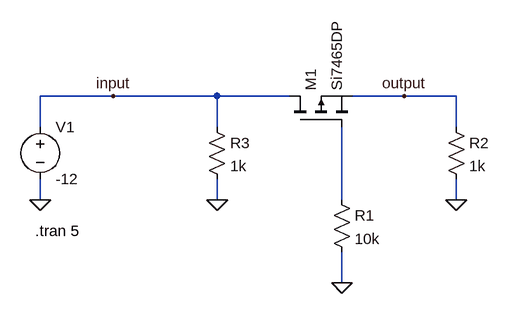
[diagram p0: schematic Simple RPP.asc]
Simple RPP.asc, the LTspice schematic file:
Version 4.1
SHEET 1 880 680
WIRE -112 128 -224 128
WIRE 48 128 -112 128
WIRE 160 128 48 128
WIRE 336 128 256 128
WIRE 416 128 336 128
WIRE -224 176 -224 128
WIRE 48 176 48 128
WIRE 416 176 416 128
WIRE -224 288 -224 256
WIRE 48 288 48 256
WIRE 240 288 240 176
WIRE 416 288 416 256
WIRE 240 416 240 368
FLAG 240 416 0
FLAG -224 288 0
FLAG 416 288 0
FLAG 48 288 0
FLAG -112 128 input
FLAG 336 128 output
SYMBOL pmos 160 176 R270
SYMATTR InstName M1
SYMATTR Value Si7465DP
SYMBOL res 224 272 R0
SYMATTR InstName R1
SYMATTR Value 10k
SYMBOL voltage -224 160 R0
WINDOW 123 0 0 Left 0
WINDOW 39 0 0 Left 0
SYMATTR InstName V1
SYMATTR Value -12
SYMBOL res 400 160 R0
SYMATTR InstName R2
SYMATTR Value 1k
SYMBOL res 32 160 R0
SYMATTR InstName R3
SYMATTR Value 1k
TEXT -232 336 Left 2 !.tran 5

The netlist it stands for:
* Simple RPP.asc
M1 input N001 output output Si7465DP
R1 N001 0 10k
V1 input 0 -12
R2 output 0 1k
R3 input 0 1k
.model NMOS NMOS
.model PMOS PMOS
.lib standard.mos
.tran 5
.backanno
.end